# EAGLE design led_matrix (EAGLE 9.6.2)
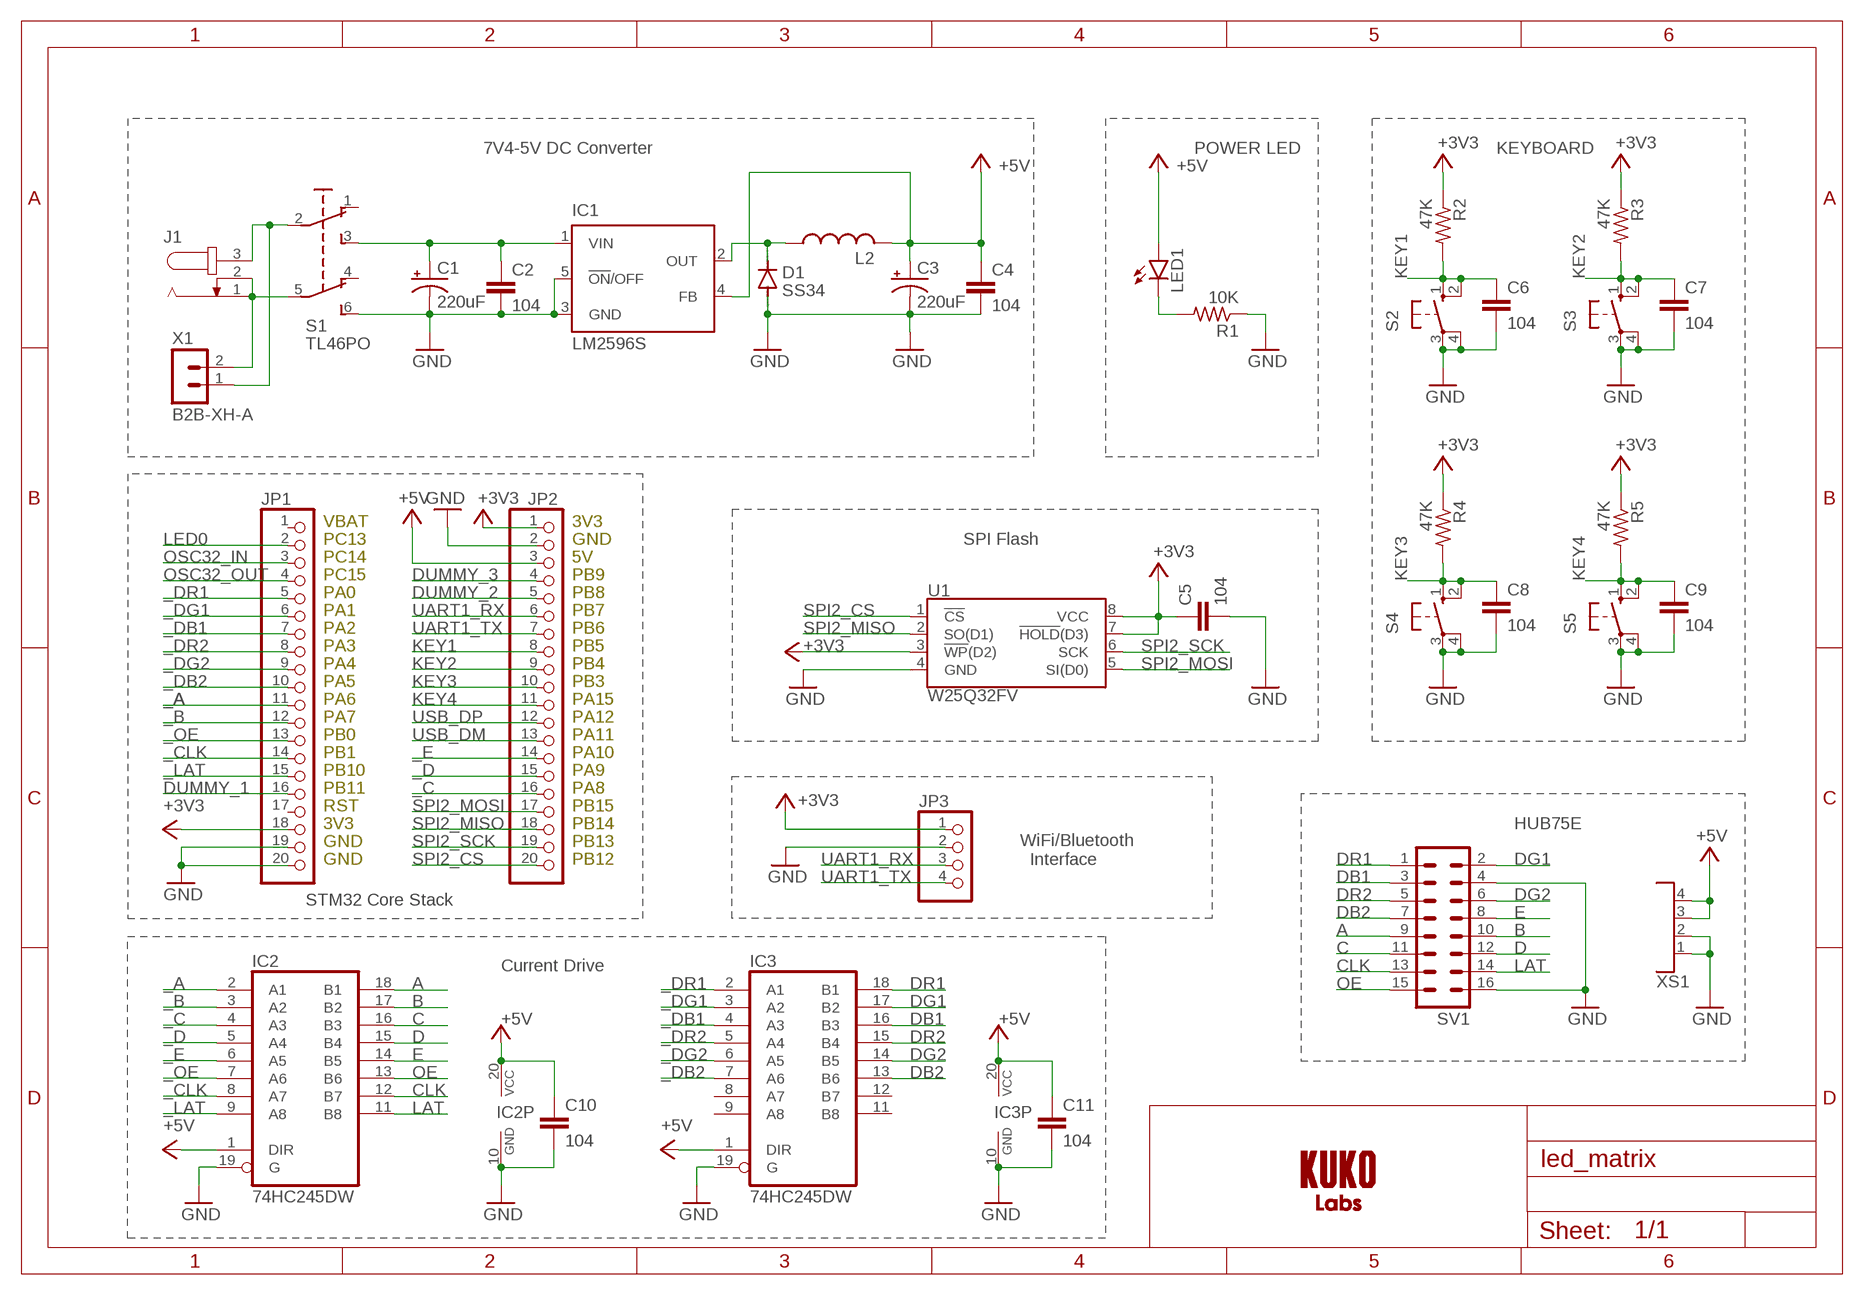
[diagram p0: schematic, sheet 1]

## Parts
C1  220uF  CPOL-US153CLV-0605  [153CLV-0605]
C2  104  C-EUC0805  [C0805]
C3  220uF  CPOL-US153CLV-0605  [153CLV-0605]
C4  104  C-EUC0805  [C0805]
C5  104  C-EUC0805  [C0805]
C6  104  C-EUC0805  [C0805]
C7  104  C-EUC0805  [C0805]
C8  104  C-EUC0805  [C0805]
C9  104  C-EUC0805  [C0805]
C10  104  C-EUC0805  [C0805]
C11  104  C-EUC0805  [C0805]
D1  SS34  DIODE-DO214AC  [DO214AC]
IC1  LM2596S  [TO263-5]
IC2  74HC245DW  [SO20W]
IC3  74HC245DW  [SO20W]
J1  JACK-PLUG0  [SPC4077]
JP1  PINHD-1X20  [1X20]
JP2  PINHD-1X20  [1X20]
JP3  PINHD-1X4  [1X04]
L2  L-USL4532P  [L4532P]
LED1  LEDCHIP-LED0805  [CHIP-LED0805]
R1  10K  R-US_R0805  [R0805]
R2  47K  R-US_R0805  [R0805]
R3  47K  R-US_R0805  [R0805]
R4  47K  R-US_R0805  [R0805]
R5  47K  R-US_R0805  [R0805]
S1  TL46PO  [TL4XPO]
S2  10-XX  [B3F-10XX]
S3  10-XX  [B3F-10XX]
S4  10-XX  [B3F-10XX]
S5  10-XX  [B3F-10XX]
SV1  ML16  [ML16]
U1  W25Q32FV  W25Q32FVSS  [SOIC-8]
U$1  LOGO  [LOGO]
X1  B2B-XH-A  [B2B-XH-A]
XS1  C4  [NINIGI4C]

## Nets
+3V3: C5.1 JP1.18 JP2.1 JP3.1 R2.1 R3.1 R4.1 R5.1 U1.3(!WP!(D2)) U1.7(!HOLD!(D3)) U1.8(VCC)
+5V: C3.+ C4.1 C10.1 C11.1 IC1.4(FB) IC2.1(DIR) IC2.20(VCC) IC3.1(DIR) IC3.20(VCC) JP2.3 L2.2 LED1.A XS1.3 XS1.4
_A: IC2.2(A1) JP1.11
_B: IC2.3(A2) JP1.12
_C: IC2.4(A3) JP2.16
_CLK: IC2.8(A7) JP1.14
_D: IC2.5(A4) JP2.15
_DB1: IC3.4(A3) JP1.7
_DB2: IC3.7(A6) JP1.10
_DG1: IC3.3(A2) JP1.6
_DG2: IC3.6(A5) JP1.9
_DR1: IC3.2(A1) JP1.5
_DR2: IC3.5(A4) JP1.8
_E: IC2.6(A5) JP2.14
_LAT: IC2.9(A8) JP1.15
_OE: IC2.7(A6) JP1.13
A: IC2.18(B1) SV1.9
B: IC2.17(B2) SV1.10
C: IC2.16(B3) SV1.11
CLK: IC2.12(B7) SV1.13
D: IC2.15(B4) SV1.12
DB1: IC3.16(B3) SV1.3
DB2: IC3.13(B6) SV1.7
DG1: IC3.17(B2) SV1.2
DG2: IC3.14(B5) SV1.6
DR1: IC3.18(B1) SV1.1
DR2: IC3.15(B4) SV1.5
DUMMY_1: JP1.16
DUMMY_2: JP2.5
DUMMY_3: JP2.4
E: IC2.14(B5) SV1.8
GND: C1.- C2.2 C3.- C4.2 C5.2 C6.2 C7.2 C8.2 C9.2 C10.2 C11.2 D1.A IC1.3(GND) IC1.5(!ON!/OFF) IC2.10(GND) IC2.19(G) IC3.10(GND) IC3.19(G) JP1.19 JP1.20 JP2.2 JP3.2 R1.1 S1.6(S1) S2.3(P) S2.4(P1) S3.3(P) S3.4(P1) S4.3(P) S4.4(P1) S5.3(P) S5.4(P1) SV1.4 SV1.16 U1.4(GND) XS1.1 XS1.2
KEY1: C6.1 JP2.8 R2.2 S2.1(S) S2.2(S1)
KEY2: C7.1 JP2.9 R3.2 S3.1(S) S3.2(S1)
KEY3: C8.1 JP2.10 R4.2 S4.1(S) S4.2(S1)
KEY4: C9.1 JP2.11 R5.2 S5.1(S) S5.2(S1)
LAT: IC2.11(B8) SV1.14
LED0: JP1.2
N$1 [7V4]: J1.3 S1.2(P) X1.1
N$2 [7V4]: J1.1 J1.2 S1.5(P1) X1.2
N$3 [7V4]: C1.+ C2.1 IC1.1(VIN) S1.3(S)
N$4: D1.C IC1.2(OUT) L2.1
N$5: LED1.C R1.2
OE: IC2.13(B6) SV1.15
OSC32_IN: JP1.3
OSC32_OUT: JP1.4
SPI2_CS: JP2.20 U1.1(!CS!)
SPI2_MISO: JP2.18 U1.2(SO(D1))
SPI2_MOSI: JP2.17 U1.5(SI(D0))
SPI2_SCK: JP2.19 U1.6(SCK)
UART1_RX: JP2.6 JP3.3
UART1_TX: JP2.7 JP3.4
USB_DM: JP2.13
USB_DP: JP2.12
Unconnected: IC3.8(A7) IC3.9(A8) IC3.11(B8) IC3.12(B7) JP1.1 JP1.17 S1.1(O) S1.4(O1)

## Notes on the sheet
- 7V4-5V DC Converter | POWER LED | KEYBOARD
- VBAT | 3V3
- PC13 | GND | SPI Flash
- PC14 | 5V
- PC15 | PB9
- PA0 | PB8
- PA1 | PB7
- PA2 | PB6
- PA3 | PB5
- PA4 | PB4
- PA5 | PB3
- PA6 | PA15
- PA7 | PA12
- PB0 | PA11
- PB1 | PA10
- PB10 | PA9
- PB11 | PA8
- RST | PB15
- 3V3 | PB14 | HUB75E
- GND | PB13
- GND | PB12
- WiFi/Bluetooth
    Interface
- STM32 Core Stack
- Current Drive

## Library data of the parts
C1 C3 = rcl:CPOL-US: POLARIZED CAPACITOR, American symbol; SPICEPREFIX: C
C2 C4-C11 = rcl:C-EU: CAPACITOR, European symbol; SPICEPREFIX: C
D1 = diode:DIODE-: DIODE
IC1 = national-semiconductor:LM2596: SIMPLE SWITCHER® Power Converter 150 kHz 3A Step-Down Voltage Regulator Source: http://www.national.com/ds/LM/LM2596.pdf; MF: NATIONAL SEMICONDUCTOR; MPN: LM2596S-ADJ/NOPB; OC_FARNELL: 9494367; OC_NEWARK: 41K3842
IC2 IC3 = 74xx-eu:74*245: Octal BUS TRANSCEIVER, 3-state
J1 = con-jack:JACK-PLUG: DC POWER JACK Power Jack, DC, Right Angle, Through Hole, Rated 5A at 16VDC, PC Terminals Distributor: Farnell (www.Farnell.de) Drawing: 84N1161.pdf / 84N1162.pdf Manufacturer: SPC Technology (www.spctechnology.com) Type: SPC4077 / SPC 4078; OC_FARNELL: unknown; OC_NEWARK: unknown
JP1 JP2 = pinhead:PINHD-1X20: PIN HEADER
JP3 = pinhead:PINHD-1X4: PIN HEADER
L2 = rcl:L-US: INDUCTOR, American symbol; SPICEPREFIX: L
LED1 = led:LED: LED OSRAM: - CHIPLED LG R971, LG N971, LY N971, LG Q971, LY Q971, LO R971, LY R971 LH N974, LH R974 LS Q976, LO Q976, LY Q976 LO Q996 - Hyper CHIPLED LW Q18S LB Q993, LB Q99A, LB R99A - SideLED LS A670, LO A670, LY A670, LG A670, LP A670 LB A673, LV A673, LT A673, LW A673 LH A674 LY A675 LS A676, LA A676, LO A676, LY A676, LW A676 LS A679, LY A679, LG A679 - Hyper Micro SIDELED® LS Y876, LA Y876, LO Y876, LY Y876 LT Y87S - SmartLED LW L88C, LW L88S LB L89C, LB L89S, LG L890 LS L89K, LO L89K, LY L89K LS L896, LA L896, LO L896, LY L896 - TOPLED LS T670, LO T670, LY T670, LG T670, LP T670 LSG T670, LSP T670, LSY T670, LOP T670, LYG T670 LG T671, LOG T671, LSG T671 LB T673, LV T673, LT T673, LW T673 LH T674 LS T676, LA T676, LO T676, LY T676, LB T676, LH T676, LSB T676, LW T676 LB T67C, LV T67C, LT T67C, LS T67K, LO T67K, LY T67K, LW E67C LS E67B, LA E67B, LO E67B, LY E67B, LB E67C, LV E67C, LT E67C LW T67C LS T679, LY T679, LG T679 LS T770, LO T770, LY T770, LG T770, LP T770 LB T773, LV T773, LT T773, LW T773 LH T774 LS E675, LA E675, LY E675, LS T675 LS T776, LA T776, LO T776, LY T776, LB T776 LHGB T686 LT T68C, LB T68C - Hyper Mini TOPLED® LB M676 - Mini TOPLED Santana® LG M470 LS M47K, LO M47K, LY M47K Source: http://www.osram.convergy.de LUXEON: - LUMILED® LXK2-PW12-R00, LXK2-PW12-S00, LXK2-PW14-U00, LXK2-PW14-V00 LXK2-PM12-R00, LXK2-PM12-S00, LXK2-PM14-U00 LXK2-PE12-Q00, LXK2-PE12-R00, LXK2-PE12-S00, LXK2-PE14-T00, LXK2-PE14-U00 LXK2-PB12-K00, LXK2-PB12-L00, LXK2-PB12-M00, LXK2-PB14-N00, LXK2-PB14-P00, LXK2-PB14-Q00 LXK2-PR12-L00, LXK2-PR12-M00, LXK2-PR14-Q00, LXK2-PR14-R00 LXK2-PD12-Q00, LXK2-PD12-R00, LXK2-PD12-S00 LXK2-PH12-R00, LXK2-PH12-S00 LXK2-PL12-P00, LXK2-PL12-Q00, LXK2-PL12-R00 Source: www.luxeon.com KINGBRIGHT: KA-3528ASYC Source: www.kingbright.com
R1-R5 = rcl:R-US_: RESISTOR, American symbol; SPICEPREFIX: R
S1 = switch:TL46PO: TINY SWITCH ON - ON Source: http://www2.produktinfo.conrad.com/datenblaetter/700000-724999/705152-da-01-de-Subminiaturschalter_TL_36YO.pdf
S2-S5 = switch-omron:10-XX: OMRON SWITCH; MPN: B3F-1000; OC_FARNELL: 176432; OC_NEWARK: 36M3542
SV1 = con-ml:ML16: HARTING; OC_FARNELL: unknown; OC_NEWARK: unknown
U1 = SparkFun-IC-Memory:W25Q32FV: W25Q32FV 32Mb (4MB) Serial Flash Memory The W25Q32FV support the standard Serial Peripheral Interface (SPI), Dual/Quad I/O SPI as well as 2-clocks instruction cycle Quad Peripheral Interface (QPI). 104MHz, SPI, 8-SOIC-EIAJ Datasheet <http://www.winbond.com/resource-files/w25q32fv%20revh%20091613.pdf> SparkFun Products SparkFun Blynk Board - ESP8266 <https://www.sparkfun.com/products/13794> (WRL-13794); PROD_ID: IC-13229
U$1 = KUKOLabs:LOGO?
X1 = con-JST XH:B2B-XH: JST XH series header 2.50mm pitch disconnectable crimp style connectors, vertical (side entry type), 2 pins
XS1 = con-ninigi-3.96:C4: NINIGI

## Net classes
0 default: clearance 0.205 mm

## Board
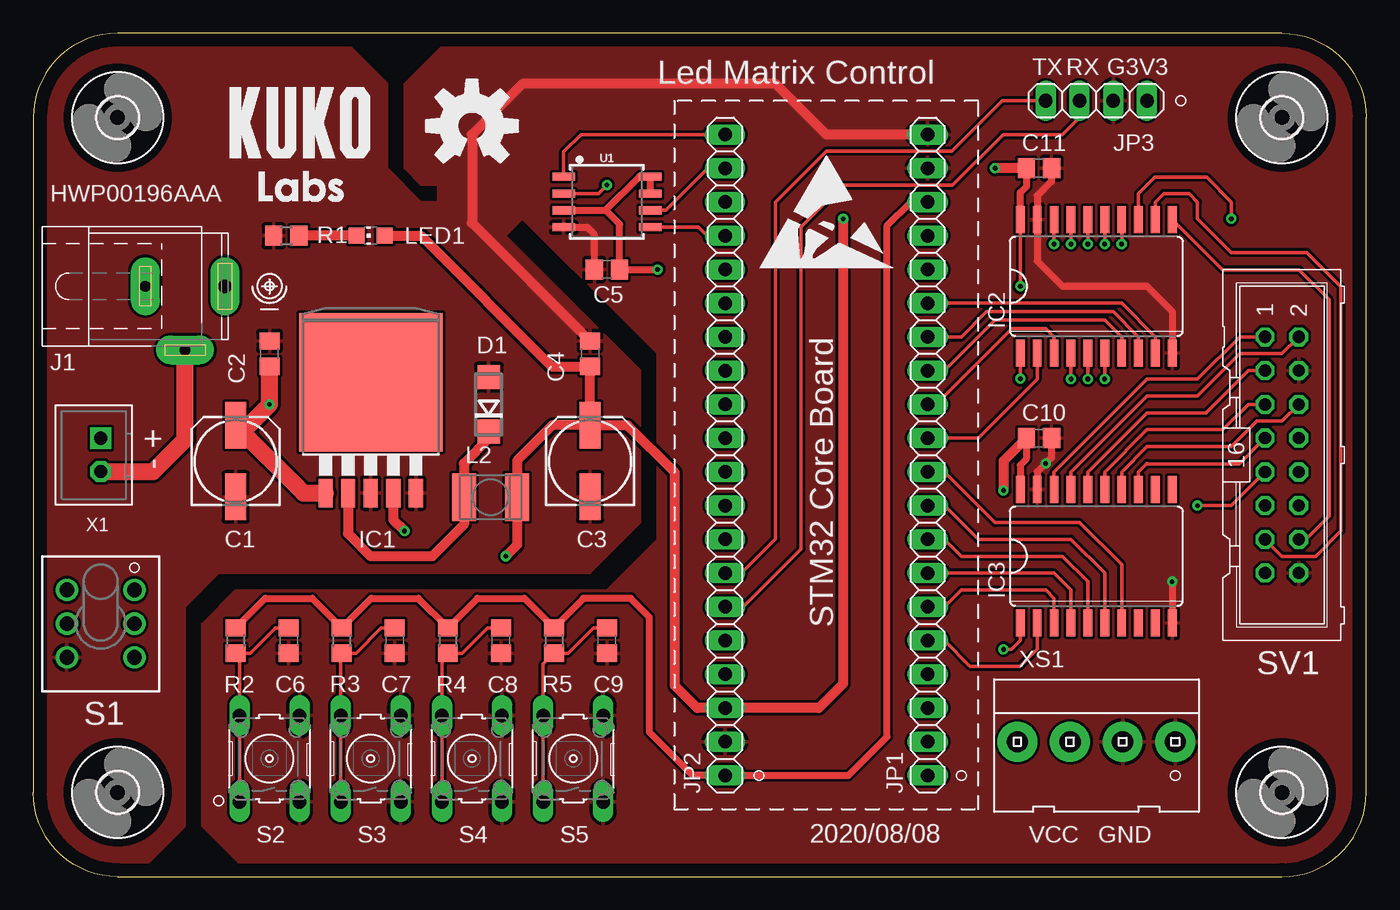
[diagram p1: board, top side]
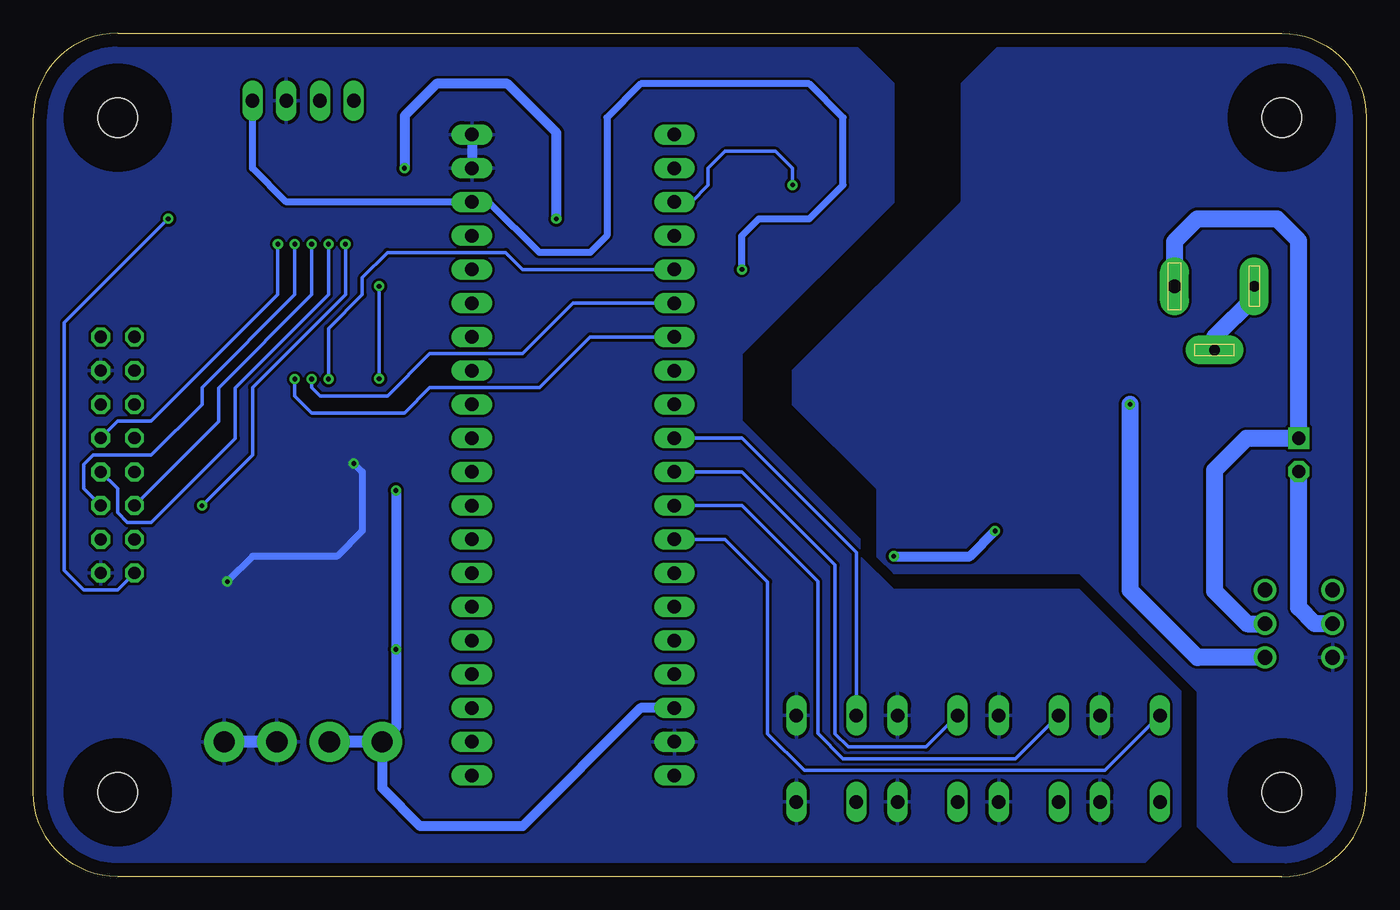
[diagram p2: board, bottom side, seen from below]

Size 100.33 x 63.5 mm. Coordinates in mm from the lower left corner, seen from the top.
Outline: 6.35,0 93.98,0 arc90 100.33,6.35 100.33,57.15 arc90 93.98,63.5 6.35,63.5 arc90 0,57.15 0,6.35 arc90 6.35,0
Copper layers (1*16): Top 0.035mm / dielectric 1.5mm / Bottom 0.035mm
Design rules "led_matrix *": minimum track width 6mil, minimum drill 0.35mm, track to track 0.205mm, track to pad 0.205mm, pad to pad 0.205mm, via to via 0.205mm, smd to smd 6mil, copper to edge 40mil, drill to drill 6mil, minimum pad ring 10mil, minimum via ring 8mil, stop-mask expansion 4mil, vias tented up to drill 30mil, thermal gap 10mil

### Footprints (pad centres in the part's own frame; a part is rotated, then mirrored left to right if it is on the bottom)
153CLV-0605 = smd 3.5 x 1.6: + 2.7,0; - -2.7,0
C0805 = smd 1.3 x 1.5: 1 -0.95,0; 2 0.95,0
DO214AC = smd 1.8 x 1.7: A 2.05,0; C -2.05,0
TO263-5 = smd 1.067 x 2.159: 1 -3.404,-5.791; 2 -1.702,-5.791; 3 0,-5.791; 4 1.702,-5.791; 5 3.404,-5.791 | smd 10.8 x 10.41: 6 0,2.54
SO20W = smd 0.66 x 2.032: 1 -5.715,-5.029; 2 -4.445,-5.029; 3 -3.175,-5.029; 4 -1.905,-5.029; 5 -0.635,-5.029; 6 0.635,-5.029; 7 1.905,-5.029; 8 3.175,-5.029; 9 4.445,-5.029; 10 5.715,-5.029; 11 5.715,5.029; 12 4.445,5.029; 13 3.175,5.029; 14 1.905,5.029; 15 0.635,5.029; 16 -0.635,5.029; 17 -1.905,5.029; 18 -3.175,5.029; 19 -4.445,5.029; 20 -5.715,5.029
SPC4077 = drill 0.8 pad 2.184 long: 1 -3,0; 2 0,-4.8 | drill 1 pad 2.184 long: 3 3,0
1X20 = drill 1.016 long: 1 -24.13,0; 2 -21.59,0; 3 -19.05,0; 4 -16.51,0; 5 -13.97,0; 6 -11.43,0; 7 -8.89,0; 8 -6.35,0; 9 -3.81,0; 10 -1.27,0; 11 1.27,0; 12 3.81,0; 13 6.35,0; 14 8.89,0; 15 11.43,0; 16 13.97,0; 17 16.51,0; 18 19.05,0; 19 21.59,0; 20 24.13,0
1X04 = drill 1.016 long: 1 -3.81,0; 2 -1.27,0; 3 1.27,0; 4 3.81,0
L4532P = smd 1.8 x 3.6: 1 -2,0; 2 2,0
CHIP-LED0805 = smd 1.2 x 1.2: A 0,-1.05; C 0,1.05
R0805 = smd 1.3 x 1.5: 1 -0.95,0; 2 0.95,0
TL4XPO = drill 1.1 pad 1.676: 1 -2.54,2.54; 2 0,2.54; 3 2.54,2.54; 4 -2.54,-2.54; 5 0,-2.54; 6 2.54,-2.54
B3F-10XX = drill 1.016 long: 1 -3.251,2.261; 2 3.251,2.261; 3 -3.251,-2.261; 4 3.251,-2.261
ML16 = drill 0.914 octagon: 1 -8.89,-1.27; 2 -8.89,1.27; 3 -6.35,-1.27; 4 -6.35,1.27; 5 -3.81,-1.27; 6 -3.81,1.27; 7 -1.27,-1.27; 8 -1.27,1.27; 9 1.27,-1.27; 10 1.27,1.27; 11 3.81,-1.27; 12 3.81,1.27; 13 6.35,-1.27; 14 6.35,1.27; 15 8.89,-1.27; 16 8.89,1.27
SOIC-8 = smd 0.61 x 1.702: 1 -1.905,-3.251; 2 -0.635,-3.251; 3 0.635,-3.251; 4 1.905,-3.251; 5 1.905,3.251; 6 0.635,3.251; 7 -0.635,3.251; 8 -1.905,3.251
3,0 = hole 3: 0,0
B2B-XH-A = drill 1 pad 1.6 square: 1 1.25,0 | drill 1 pad 1.6 octagon: 2 -1.25,0
NINIGI4C = drill 1.6 pad 3: 1 -5.94,0; 2 -1.98,0; 3 1.98,0; 4 5.94,0

### Placement (x,y rotation side)
C1  15.24,31.29 90 top
C2  17.78,39.37 90 top
C3  41.91,31.29 90 top
C4  41.91,39.37 90 top
C5  43.18,45.72 180 top
C6  19.23,17.78 270 top
C7  27.21,17.78 270 top
C8  35.2,17.78 270 top
C9  43.18,17.78 270 top
C10  75.69,33.02 0 top
C11  75.69,53.34 0 top
D1  34.29,35.56 90 top
IC1  25.4,34.67 0 top
IC2  80.01,44.45 0 top
IC3  80.01,24.13 0 top
J1  11.43,44.45 0 top
JP1  67.31,31.75 90 top
JP2  52.07,31.75 90 top
JP3  80.01,58.42 180 top
L2  34.42,28.57 0 top
LED1  25.4,48.26 90 top
R1  19.05,48.26 0 top
R2  15.24,17.78 270 top
R3  23.22,17.78 270 top
R4  31.21,17.78 270 top
R5  39.19,17.78 270 top
S1  5.08,19.05 270 top
S2  17.78,8.89 90 top
S3  25.4,8.89 90 top
S4  33.02,8.89 90 top
S5  40.64,8.89 90 top
SV1  93.98,31.75 270 top
U1  43.18,50.8 270 top
U$1  11.94,48.64 0 top
U$2  [3,0]  6.35,57.15 180 top
U$3  [3,0]  6.35,6.35 180 top
U$4  [3,0]  93.98,6.35 180 top
U$5  [3,0]  93.98,57.15 180 top
U$6  [ESD_10.00]  54.61,45.72 0 top
U$7  [OSHW-LOGO-L]  33.02,56.52 0 top
X1  5.08,31.75 90 top
XS1  80.01,10.16 180 top

### Tracks (layer width: path | path; a pad name or v marks a point on that pad's centre or on a via)
+3V3  (via drill 0.35)
  Top 0.254: 43.08,50.16
  Top 0.508: U1.7 U1.8 45.62,52.7 43.08,50.16 | JP1.18 66.04,50.8 64.26,49.02 64.26,10.54 61.34,7.62 JP2.1 49.63,7.62 46.38,10.87 46.38,19.53 44.96,20.96 41.4,20.96 39.19,18.74 R5.1 36.96,20.96 33.43,20.96 R4.1 28.98,20.96 25.45,20.96 R3.1 21,20.96 17.46,20.96 R2.1 | U1.3 43.08,50.16 44.13,49.11 C5.1 v46.99,45.72
  Bottom 0.508: JP3.1 83.82,53.34 81.28,50.8 JP1.18 66.04,50.8 62.23,46.99 58.42,46.99 57.15,48.26 57.15,57.15 54.61,59.69 41.91,59.69 39.37,57.15 39.37,52.07 41.91,49.53 45.72,49.53 46.99,48.26 v46.99,45.72
+5V  (via drill 0.35)
  Top 0.254: C11.1 74.75,53.33 | IC3.1 74.3,17.78 73.64,17.12 v73.03,17.12 | IC2.1 74.24,39.37 74.3,39.32 v74.3,37.49 | IC2.20 v74.3,44.45
  Top 0.508: 74.75,53.33 74.75,51.97 74.3,51.51 IC2.20 | C10.1 74.74,31.43 74.3,30.99 IC3.20
  Top 0.762: C3.+ 39.08,33.99 36.42,31.33 L2.2 36.42,24.99 v35.56,24.13 | C10.1 73.03,31.3 v73.03,29.08 | C3.+ 44.73,33.98 48.28,30.43 48.28,14.38 49.96,12.7 JP2.3 59.13,12.7 60.96,14.53 v60.96,49.53 | IC1.4 27.1,26.87 v27.94,26.04 | C3.+ C4.1 39.02,38.42 29.18,48.26 LED1.A | C11.1 v72.39,53.34
  Bottom 0.254: v74.3,44.45 v74.3,37.49
  Bottom 0.762: JP2.3 54.61,12.7 63.5,3.81 71.2,3.81 74.07,6.68 XS1.4 73.03,11.2 v73.03,17.12 v73.03,29.08 | v60.96,49.53 60.96,56.01 64.64,59.69 69.98,59.69 72.38,57.29 72.38,53.35 v72.39,53.34 | v35.56,24.13 29.84,24.13 v27.94,26.04
  Bottom 0.914: XS1.4 XS1.3
_A
  Top 0.254: IC2.2 75.56,37.47 71.12,33.02 JP1.11
_B
  Top 0.254: JP1.12 67.94,35.56 73.66,41.27 76.2,41.27 76.83,40.64 IC2.3
_C  (via drill 0.35)
  Top 0.254: IC2.4 v78.11,37.47
  Bottom 0.254: v78.11,37.47 78.11,41.27 75.56,43.81 75.56,45.08 73.66,46.99 64.77,46.99 63.5,45.72 JP2.16
_CLK
  Top 0.254: JP1.14 69.85,40.64 71.75,42.55 81.28,42.55 83.19,40.64 IC2.8
_D  (via drill 0.35)
  Top 0.254: IC2.5 v79.38,37.47
  Bottom 0.254: v79.38,37.47 79.38,36.83 78.74,36.19 73.66,36.19 70.48,39.37 63.5,39.37 59.69,43.18 JP2.15
_DB1
  Top 0.254: IC3.4 78.11,21.59 76.83,22.86 JP1.7
_DB2
  Top 0.254: IC3.7 81.92,23.5 78.74,26.67 72.39,26.67 68.58,30.48 JP1.10
_DG1
  Top 0.254: IC3.3 76.83,20.96 76.2,21.59 69.85,21.59 68.58,20.32 JP1.6
_DG2
  Top 0.254: IC3.6 80.64,22.86 78.11,25.4 71.12,25.4 68.58,27.94 JP1.9
_DR1
  Top 0.254: IC3.2 75.56,17.14 74.27,15.85 70.51,15.85 68.58,17.78 JP1.5
_DR2
  Top 0.254: IC3.5 79.38,22.22 77.47,24.13 69.85,24.13 68.58,25.4 JP1.8
_E  (via drill 0.35)
  Top 0.254: IC2.6 v80.64,37.47
  Bottom 0.254: v80.64,37.47 80.64,36.19 79.38,34.92 72.39,34.92 70.48,36.83 62.23,36.83 58.42,40.64 JP2.14
_LAT
  Top 0.254: JP1.15 81.92,43.18 84.45,40.64 IC2.9
_OE
  Top 0.254: JP1.13 68.58,38.1 72.39,41.91 80.64,41.91 81.92,40.64 IC2.7
A  (via drill 0.35)
  Top 0.254: IC2.18 v76.83,47.62 | SV1.9 90.17,27.94 v87.63,27.94
  Bottom 0.254: v76.83,47.62 76.83,43.83 83.82,36.84 83.82,31.75 v87.63,27.94
B  (via drill 0.35)
  Top 0.254: IC2.17 v78.11,47.62
  Bottom 0.254: v78.11,47.62 78.11,43.81 85.11,36.8 85.11,33 91.44,26.67 93.24,26.67 93.98,27.41 93.98,29.21 SV1.10
C  (via drill 0.35)
  Top 0.254: IC2.16 v79.38,47.62
  Bottom 0.254: SV1.11 86.39,34.27 86.39,36.8 79.38,43.81 v79.38,47.62
CLK
  Top 0.254: IC2.12 84.45,50.8 85.09,51.43 87,51.43 87.63,50.8 87.63,49.53 90.17,46.99 95.86,46.99 98.42,44.42 98.42,26.04 96.52,24.13 93.98,24.13 SV1.13
D  (via drill 0.35)
  Top 0.254: IC2.15 v80.64,47.62
  Bottom 0.254: SV1.12 96.52,29.21 96.52,31.04 95.81,31.75 91.44,31.75 87.63,35.56 87.63,36.83 80.64,43.81 v80.64,47.62
DB1
  Top 0.254: IC3.16 79.38,30.48 83.82,34.92 88.27,34.92 91.44,38.1 SV1.3
DB2
  Top 0.254: IC3.13 83.19,30.48 83.82,31.11 83.84,31.09 90.78,31.09 SV1.7
DG1
  Top 0.254: SV1.2 93.98,39.37 90.81,39.37 87.63,36.19 83.82,36.19 78.11,30.48 IC3.17
DG2
  Top 0.254: IC3.14 81.92,30.48 83.82,32.39 90.17,32.39 92.07,34.29 93.98,34.29 SV1.6
DR1
  Top 0.254: IC3.18 76.83,30.48 83.82,37.47 87.63,37.47 90.81,40.64 SV1.1
DR2
  Top 0.254: IC3.15 80.64,30.48 83.82,33.66 89.53,33.66 91.44,35.56 SV1.5
E  (via drill 0.35)
  Top 0.254: IC2.14 v81.92,47.62
  Bottom 0.254: v81.92,47.62 81.92,43.81 91.44,34.29 93.98,34.29 SV1.8
GND  (via drill 0.35)
  Top 0.508: C11.2 76.64,52.36 75.56,51.28 IC2.19 75.56,46.36 77.47,44.45 83.82,44.45 85.72,42.55 IC2.10 | C10.2 76.64,31.56 v76.2,31.11 75.56,30.48 IC3.19 | C5.2 42.23,48.36 41.7,48.89 U1.4 | v85.72,22.22 IC3.10
  Top 0.762: JP1.20 59.69,55.88 55.88,59.69 36.83,59.69 33.02,55.88 33.02,49.22 41.91,40.33 C4.2
  Bottom 0.508: v76.2,31.11 75.56,30.48 75.56,26.04 77.47,24.13 83.82,24.13 v85.72,22.22
  Bottom 0.762: JP1.20 JP1.19
  Bottom 0.914: XS1.2 XS1.1
  pour Top: 43.18,40.64 34.29,49.53 33.02,50.8 31.75,50.8 29.21,50.8 26.67,53.34 26.67,58.42 26.67,59.69 21.59,64.77 20.32,66.04 19.05,66.04 1.27,66.04 -2.54,62.23 -2.54,2.54 2.54,-2.54 5.08,-2.54 11.43,3.81 11.43,20.32 13.97,22.86 41.91,22.86 45.72,26.67 45.72,38.1
  pour Top: 27.94,59.69 34.29,66.04 97.79,66.04 102.87,60.96 102.87,2.54 97.79,-2.54 19.05,-2.54 12.7,3.81 12.7,19.05 15.24,21.59 43.18,21.59 46.99,25.4 46.99,39.37 34.29,52.07 29.21,52.07 27.94,53.34
  pour Top: 30.48,53.34 35.56,53.34 36.83,52.07 36.83,50.8 36.83,49.53 34.29,46.99 30.48,46.99
  pour Bottom: 35.56,59.69 43.18,67.31 97.79,67.31 104.14,60.96 104.14,2.54 97.79,-3.81 21.59,-3.81 20.32,-2.54 13.97,3.81 13.97,13.97 21.59,21.59 35.56,21.59 38.1,24.13 38.1,25.4 46.99,34.29 46.99,39.37 35.56,50.8
  pour Bottom: 12.7,3.81 5.08,-3.81 2.54,-3.81 -3.81,2.54 -3.81,63.5 0,67.31 22.86,67.31 30.48,59.69 30.48,50.8 43.18,38.1 43.18,35.56 36.83,29.21 36.83,24.13 35.56,22.86 21.59,22.86 12.7,13.97
KEY1
  Top 0.254: S2.1 S2.2 15.52,16.55 R2.2 16.32,16.83 18.16,18.67 18.21,18.73 C6.1
  Bottom 0.254: S2.2 19.66,8 42.29,8 45.06,10.77 45.06,22.2 48.26,25.4 JP2.8
KEY2
  Top 0.254: S3.1 S3.2 23.14,16.75 R3.2 24.3,16.83 26.2,18.73 C7.1
  Bottom 0.254: JP2.9 46.99,27.94 41.27,22.22 41.27,10.79 39.37,8.89 26.39,8.89 S3.2
KEY3
  Top 0.254: S4.1 S4.2 30.76,16.38 R4.2 32.28,16.83 34.18,18.73 C8.1
  Bottom 0.254: S4.2 33.13,9.77 38.98,9.77 39.98,10.77 39.98,23.47 46.99,30.48 JP2.10
KEY4
  Top 0.254: S5.1 S5.2 38.38,16.02 R5.2 40.26,16.83 42.16,18.73 C9.1
  Bottom 0.254: S5.2 38.38,24.41 46.99,33.02 JP2.11
LAT
  Top 0.254: IC2.11 89.53,45.67 95.3,45.67 97.54,43.43 97.54,27.18 95.76,25.4 SV1.14
N$1
  Bottom 1.27: J1.3 14.43,47.8 12.7,49.53 6.73,49.53 5.08,47.88 X1.1 9.02,33 11.43,30.59 11.43,21.51 8.97,19.05 S1.2
N$2
  Top 0.762: 5.11,30.47 X1.2
  Top 1.27: J1.2 11.43,32.9 9,30.47 5.11,30.47
  Bottom 1.27: S1.5 3.86,19.05 5.08,20.27 X1.2 | J1.2 11.43,40.61 8.43,43.61 J1.1
N$3  (via drill 0.35)
  Top 1.27: IC1.1 20.34,28.88 15.24,33.98 | C1.+ 15.24,33.98 | C2.1 v17.78,35.56 16.2,33.98 15.24,33.98
  Bottom 1.27: S1.3 12.7,16.51 17.78,21.59 v17.78,35.56
N$4
  Top 0.762: IC1.2 23.7,25.83 25.4,24.13 30.02,24.13 32.42,26.52 L2.1 32.41,31.11 34.29,33 D1.C
N$5
  Top 0.762: LED1.C R1.2
OE  (via drill 0.35)
  Top 0.254: v90.17,49.53 90.17,50.8 88.32,52.65 84.4,52.65 83.19,51.43 IC2.13
  Bottom 0.254: v90.17,49.53 97.99,41.71 97.99,23.06 96.52,21.59 93.98,21.59 SV1.15
SPI2_CS
  Top 0.254: U1.1 39.93,54.58 41.22,55.88 JP2.20
SPI2_MISO  (via drill 0.35)
  Top 0.254: U1.2 42.55,51.43 v43.18,52.07
  Bottom 0.254: v43.18,52.07 43.18,53.34 44.45,54.61 48.26,54.61 49.53,53.34 49.53,52.07 50.8,50.8 JP2.18
SPI2_MOSI
  Top 0.254: JP2.17 50.7,48.26 50.06,48.89 U1.5
SPI2_SCK
  Top 0.254: JP2.19 50.8,53.34 47.62,50.16 U1.6
UART1_RX
  Top 0.254: JP2.6 53.42,20.32 57.78,24.69 57.78,48.89 60.96,52.07 69.19,52.07 73,55.88 77.47,55.88 78.74,57.15 JP3.3
UART1_TX
  Top 0.254: JP2.7 53.31,22.86 55.88,25.43 55.88,50.8 59.69,54.61 69.14,54.61 72.95,58.42 JP3.4

### Text on the board
tPlace: TX | RX | G | 3V3 | Led Matrix Control | HWP00196AAA | STM32 Core Board | + | - | 2020/08/08 | VCC GND